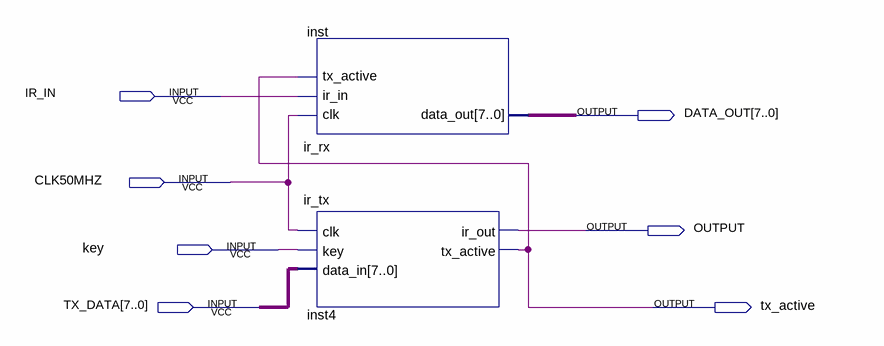
[diagram p0: schematic sheet]
// Quartus schematic top.bdf as structural Verilog: 2 symbols, 7 pins
module top (
  input  IR_IN,
  input  CLK50MHZ,
  input  key,
  input  [7:0] TX_DATA,
  output [7:0] DATA_OUT,
  output OUTPUT,
  output tx_active
);

  ir_rx inst (.clk(CLK50MHZ), .ir_in(IR_IN), .tx_active(tx_active), .data_out(DATA_OUT));
  ir_tx inst4 (.clk(CLK50MHZ), .key(key), .data_in(TX_DATA), .ir_out(OUTPUT), .tx_active(tx_active));
endmodule
